# Altium schematic sheet 外设驱动部分.SchDoc
size A2
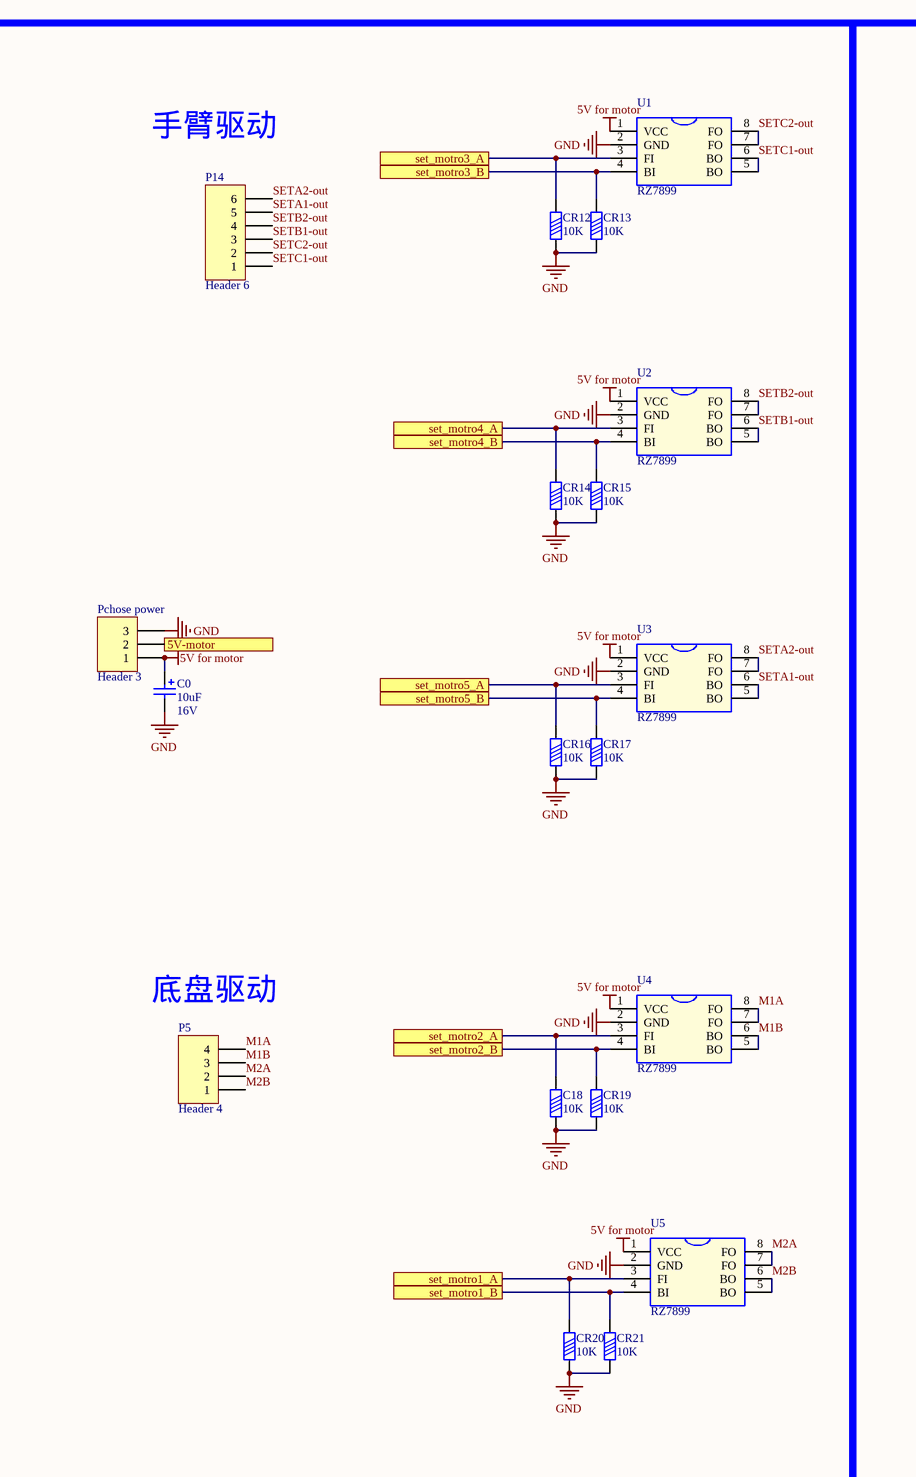
[diagram p0: 外设驱动部分.SchDoc, left]
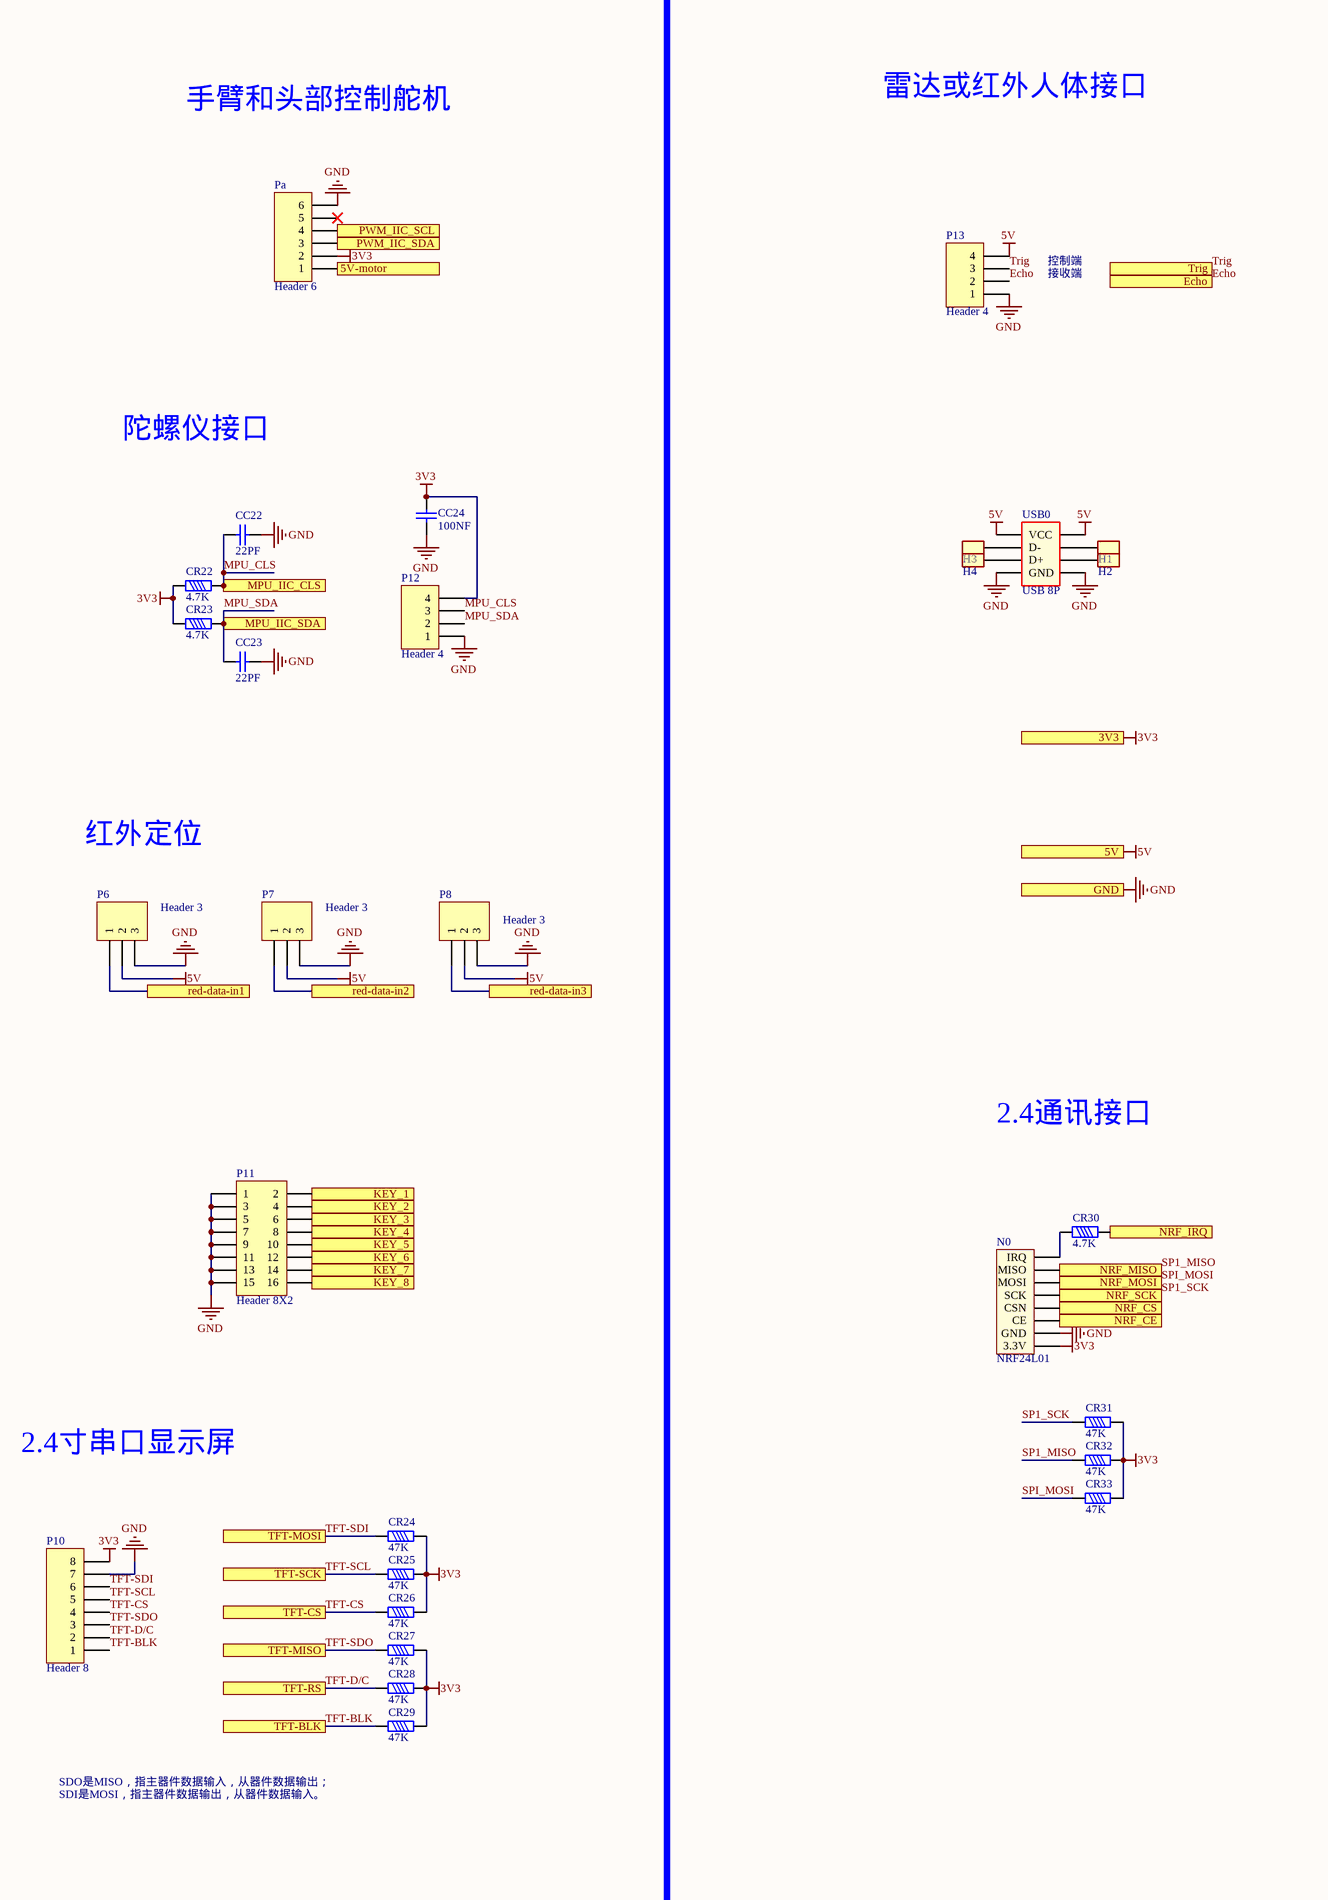
[diagram p1: 外设驱动部分.SchDoc, right]

## Parts
C0  value 10uF  Voltage: 16V  [CAPPR2.5-6.3X5]  (hidden comment: Cap Pol 2.5x6.3)
C18  value 10K  [CR1608-0603]  (hidden comment: Resistor Chip 0603)
CC22  value 22PF  [CC1608-0603]  (hidden comment: Cap Chip 0603)
CC23  value 22PF  [CC1608-0603]  (hidden comment: Cap Chip 0603)
CC24  value 100NF  [CC1608-0603]  (hidden comment: Cap Chip 0603)
CR12  value 10K  [CR1608-0603]  (hidden comment: Resistor Chip 0603)
CR13  value 10K  [CR1608-0603]  (hidden comment: Resistor Chip 0603)
CR14  value 10K  [CR1608-0603]  (hidden comment: Resistor Chip 0603)
CR15  value 10K  [CR1608-0603]  (hidden comment: Resistor Chip 0603)
CR16  value 10K  [CR1608-0603]  (hidden comment: Resistor Chip 0603)
CR17  value 10K  [CR1608-0603]  (hidden comment: Resistor Chip 0603)
CR19  value 10K  [CR1608-0603]  (hidden comment: Resistor Chip 0603)
CR20  value 10K  [CR1608-0603]  (hidden comment: Resistor Chip 0603)
CR21  value 10K  [CR1608-0603]  (hidden comment: Resistor Chip 0603)
CR22  value 4.7K  [CR1608-0603]  (hidden comment: Resistor Chip 0603)
CR23  value 4.7K  [CR1608-0603]  (hidden comment: Resistor Chip 0603)
CR24  value 47K  [CR1608-0603]  (hidden comment: Resistor Chip 0603)
CR25  value 47K  [CR1608-0603]  (hidden comment: Resistor Chip 0603)
CR26  value 47K  [CR1608-0603]  (hidden comment: Resistor Chip 0603)
CR27  value 47K  [CR1608-0603]  (hidden comment: Resistor Chip 0603)
CR28  value 47K  [CR1608-0603]  (hidden comment: Resistor Chip 0603)
CR29  value 47K  [CR1608-0603]  (hidden comment: Resistor Chip 0603)
CR30  value 4.7K  [CR1608-0603]  (hidden comment: Resistor Chip 0603)
CR31  value 47K  [CR1608-0603]  (hidden comment: Resistor Chip 0603)
CR32  value 47K  [CR1608-0603]  (hidden comment: Resistor Chip 0603)
CR33  value 47K  [CR1608-0603]  (hidden comment: Resistor Chip 0603)
H1  H0  [header 1]  (value not drawn)
H2  H0  [header 1]  (value not drawn)
H3  H0  [header 1]  (value not drawn)
H4  H0  [header 1]  (value not drawn)
N0  NRF24L01  [NRF24L01]
P5  Header 4  [HX2.54-4]
P6  Header 3  [HX2.54-3]
P7  Header 3  [HX2.54-3]
P8  Header 3  [HX2.54-3]
P10  Header 8  [HX2.54-8]
P11  Header 8X2  [HDR2X8]
P12  Header 4  [HX2.54-4]
P13  Header 4  [HX2.54-4]
P14  Header 6  [HX2.54-6]
Pa  Header 6  [HX2.54-6]
Pchose_power  Header 3  [HDR1X3]
U1  RZ7899  [SOP8]
U2  RZ7899  [SOP8]
U3  RZ7899  [SOP8]
U4  RZ7899  [SOP8]
U5  RZ7899  [SOP8]
USB0  USB 8P  [USB DIP 8]

## Ports
3V3, 5V, 5V-motor, Echo, GND, KEY_1, KEY_2, KEY_3, KEY_4, KEY_5, KEY_6, KEY_7, KEY_8, MPU_IIC_CLS, MPU_IIC_SDA, NRF_CE, NRF_CS, NRF_IRQ, NRF_MISO, NRF_MOSI, NRF_SCK, PWM_IIC_SCL, PWM_IIC_SDA, red-data-in1, red-data-in2, red-data-in3, set_motro1_A, set_motro1_B, set_motro2_A, set_motro2_B, set_motro3_A, set_motro3_B, set_motro4_A, set_motro4_B, set_motro5_A, set_motro5_B, TFT-BLK, TFT-CS, TFT-MISO, TFT-MOSI, TFT-RS, TFT-SCK, Trig

## Nets
3V3: CC24.2 CR22.1 CR23.1 CR24.2 CR25.2 CR26.2 CR27.2 CR28.2 CR29.2 CR31.2 CR32.2 CR33.2 N0.1(3.3V) P10.8 P12.4 Pa.2 ; port 3V3
5V: P6.2 P7.2 P8.2 P13.4 USB0.1(VCC) USB0.8 ; port 5V
5V for motor: C0.1 Pchose_power.1 U1.1(VCC) U2.1(VCC) U3.1(VCC) U4.1(VCC) U5.1(VCC)
GND: C0.2 C18.1 CC22.2 CC23.2 CC24.1 CR12.1 CR13.1 CR14.1 CR15.1 CR16.1 CR17.1 CR19.1 CR20.1 CR21.1 N0.2(GND) P6.3 P7.3 P8.3 P10.7 P11.1 P11.3 P11.5 P11.7 P11.9 P11.11 P11.13 P11.15 P12.1 P13.1 Pa.6 Pchose_power.3 U1.2(GND) U2.2(GND) U3.2(GND) U4.2(GND) U5.2(GND) USB0.4(GND) USB0.5 ; port GND
5V-motor: Pa.1 Pchose_power.2 ; port 5V-motor
Echo: P13.2 ; port Echo
KEY_1: P11.2 ; port KEY_1
KEY_2: P11.4 ; port KEY_2
KEY_3: P11.6 ; port KEY_3
KEY_4: P11.8 ; port KEY_4
KEY_5: P11.10 ; port KEY_5
KEY_6: P11.12 ; port KEY_6
KEY_7: P11.14 ; port KEY_7
KEY_8: P11.16 ; port KEY_8
M1A: P5.4 U4.7(FO) U4.8(FO)
M1B: P5.3 U4.5(BO) U4.6(BO)
M2A: P5.2 U5.7(FO) U5.8(FO)
M2B: P5.1 U5.5(BO) U5.6(BO)
MPU_CLS: CC22.1 CR22.2 P12.3 ; port MPU_IIC_CLS
MPU_SDA: CC23.1 CR23.2 P12.2 ; port MPU_IIC_SDA
NRF_CE: N0.3(CE) ; port NRF_CE
NRF_CS: N0.4(CSN) ; port NRF_CS
NRF_IRQ: CR30.2 ; port NRF_IRQ
PWM_IIC_SCL: Pa.4 ; port PWM_IIC_SCL
PWM_IIC_SDA: Pa.3 ; port PWM_IIC_SDA
red-data-in1: P6.1 ; port red-data-in1
red-data-in2: P7.1 ; port red-data-in2
red-data-in3: P8.1 ; port red-data-in3
set_motro1_A: CR20.2 U5.3(FI) ; port set_motro1_A
set_motro1_B: CR21.2 U5.4(BI) ; port set_motro1_B
set_motro2_A: C18.2 U4.3(FI) ; port set_motro2_A
set_motro2_B: CR19.2 U4.4(BI) ; port set_motro2_B
set_motro3_A: CR12.2 U1.3(FI) ; port set_motro3_A
set_motro3_B: CR13.2 U1.4(BI) ; port set_motro3_B
set_motro4_A: CR14.2 U2.3(FI) ; port set_motro4_A
set_motro4_B: CR15.2 U2.4(BI) ; port set_motro4_B
set_motro5_A: CR16.2 U3.3(FI) ; port set_motro5_A
set_motro5_B: CR17.2 U3.4(BI) ; port set_motro5_B
SETA1-out: P14.5 U3.5(BO) U3.6(BO)
SETA2-out: P14.6 U3.7(FO) U3.8(FO)
SETB1-out: P14.3 U2.5(BO) U2.6(BO)
SETB2-out: P14.4 U2.7(FO) U2.8(FO)
SETC1-out: P14.1 U1.5(BO) U1.6(BO)
SETC2-out: P14.2 U1.7(FO) U1.8(FO)
SP1_MISO: CR32.1 N0.7(MISO) ; port NRF_MISO
SP1_SCK: CR31.1 N0.5(SCK) ; port NRF_SCK
SPI_MOSI: CR33.1 N0.6(MOSI) ; port NRF_MOSI
TFT-BLK: CR29.1 P10.1 ; port TFT-BLK
TFT-CS: CR26.1 P10.4 ; port TFT-CS
TFT-D/C: CR28.1 P10.2 ; port TFT-RS
TFT-SCL: CR25.1 P10.5 ; port TFT-SCK
TFT-SDI: CR24.1 P10.6 ; port TFT-MOSI
TFT-SDO: CR27.1 P10.3 ; port TFT-MISO
Trig: P13.3 ; port Trig
NetCR30_1: CR30.1 N0.8(IRQ)
NetH1_1: H1.1 USB0.7
NetH2_1: H2.1 USB0.6
NetH3_1: H3.1 USB0.2(D-)
NetH4_1: H4.1 USB0.3(D+)

Not connected (* = marked no-connect by the designer): Pa 5*

## Notes on the sheet
- 手臂驱动
- 手臂和头部控制舵机
- 雷达或红外人体接口
- 控制端
- 接收端
- 陀螺仪接口
- 红外定位
- (near P5) 底盘驱动
- 2.4通讯接口
- 2.4寸串口显示屏
- SDO是MISO，指主器件数据输入，从器件数据输出；
- SDI是MOSI，指主器件数据输出，从器件数据输入。

## Library data of the parts
C0 = Cap Pol 2.5x6.3: Polarized Capacitor (Radial); Published: 8-Jun-2000; Revision: July-2002: Re-released for DXP Platform.; Publisher: Altium Limited
C18 CR12-CR17 CR19-CR33 = Resistor Chip 0603: Resistor; Published: 8-Jun-2000; Revision: July-2002: Re-released for DXP Platform.; Publisher: Altium Limited
CC22-CC24 = Cap Chip 0603: Polarized Capacitor (Radial); Published: 8-Jun-2000; Revision: July-2002: Re-released for DXP Platform.; Publisher: Altium Limited
H1-H4 = header 1
P5 P12 P13 = Header 4: Header, 4-Pin; LatestRevisionDate: 17-Jul-2002; LatestRevisionNote: Re-released for DXP Platform.; Publisher: Altium Limited
P6-P8 Pchose_power = Header 3: Header, 3-Pin; LatestRevisionDate: 17-Jul-2002; LatestRevisionNote: Re-released for DXP Platform.; Publisher: Altium Limited
P10 = Header 8: Header, 8-Pin; LatestRevisionDate: 17-Jul-2002; LatestRevisionNote: Re-released for DXP Platform.; Publisher: Altium Limited
P11 = Header 8X2: Header, 8-Pin, Dual row; LatestRevisionDate: 17-Jul-2002; LatestRevisionNote: Re-released for DXP Platform.; Publisher: Altium Limited
P14 Pa = Header 6: Header, 6-Pin; LatestRevisionDate: 17-Jul-2002; LatestRevisionNote: Re-released for DXP Platform.; Publisher: Altium Limited
U1-U5 = RZ7899: 电机驱动:输入支持3V-25V，输出支持6A
USB0 = USB DIP 8P